# EAGLE design blank_rev_3 (EAGLE 6.3)
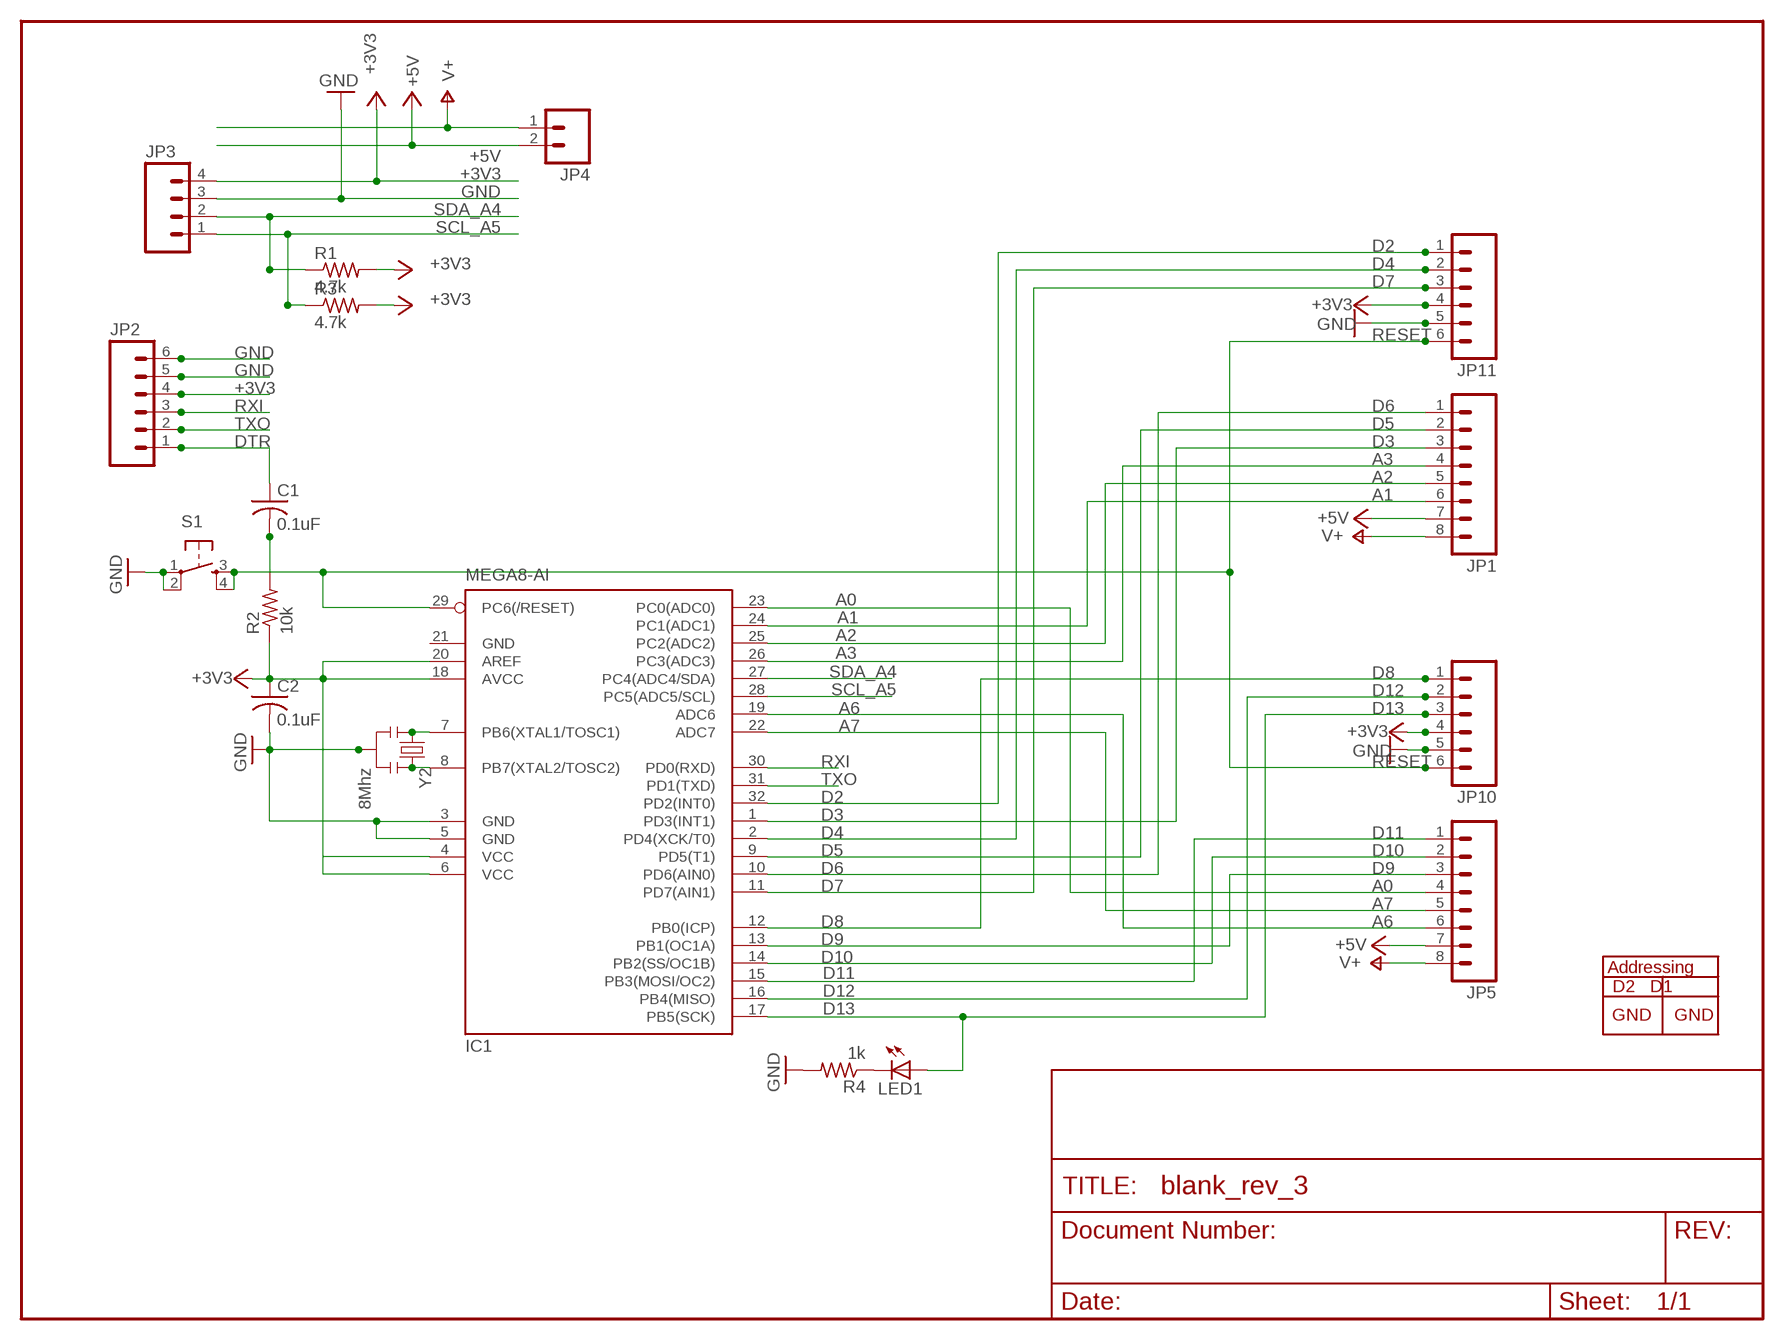
[diagram p0: schematic, sheet 1]

## Parts
C1  0.1uF  C-US025-024X044  [C025-024X044]
C2  0.1uF  C-US025-024X044  [C025-024X044]
IC1  MEGA8-AI  [TQFP32-08]
JP1  M081X08  [1X08]
JP2  M06SIP  [1X06]
JP3  M04PTH  [1X04]
JP4  M02PTH  [1X02]
JP5  M081X08  [1X08]
JP10  M06SIP  [1X06]
JP11  M06SIP  [1X06]
LED1  LED3MM  [LED3MM]
R1  4.7k  R-US_0204/7  [0204/7]
R2  10k  R-US_0204/7  [0204/7]
R3  4.7k  R-US_0204/7  [0204/7]
R4  1k  R-US_0204/7  [0204/7]
S1  TAC_SWITCHPTH  [TACTILE-PTH]
Y2  8Mhz  RESONATORPTH  [RESONATOR-PTH]

## Nets
+3V3: C2.1 IC1.4(VCC) IC1.6(VCC) IC1.18(AVCC) IC1.20(AREF) JP2.4 JP3.4 JP10.4 JP11.4 R1.2 R2.1 R3.2
+5V: JP1.7 JP4.2 JP5.7
A0: IC1.23(PC0(ADC0)) JP5.4
A1: IC1.24(PC1(ADC1)) JP1.6
A2: IC1.25(PC2(ADC2)) JP1.5
A3: IC1.26(PC3(ADC3)) JP1.4
A6: IC1.19(ADC6) JP5.6
A7: IC1.22(ADC7) JP5.5
D2: IC1.32(PD2(INT0)) JP11.1
D3: IC1.1(PD3(INT1)) JP1.3
D4: IC1.2(PD4(XCK/T0)) JP11.2
D5: IC1.9(PD5(T1)) JP1.2
D6: IC1.10(PD6(AIN0)) JP1.1
D7: IC1.11(PD7(AIN1)) JP11.3
D8: IC1.12(PB0(ICP)) JP10.1
D9: IC1.13(PB1(OC1A)) JP5.3
D10: IC1.14(PB2(SS/OC1B)) JP5.2
D11: IC1.15(PB3(MOSI/OC2)) JP5.1
D12: IC1.16(PB4(MISO)) JP10.2
D13: IC1.17(PB5(SCK)) JP10.3 LED1.A
DTR: C1.1 JP2.1
GND: C2.2 IC1.3(GND) IC1.5(GND) JP2.5 JP2.6 JP3.3 JP10.5 JP11.5 R4.2 S1.1 S1.2 Y2.2
N$1: IC1.8(PB7(XTAL2/TOSC2)) Y2.3
N$3: IC1.7(PB6(XTAL1/TOSC1)) Y2.1
N$4: LED1.K(C) R4.1
RESET: C1.2 IC1.29(PC6(/RESET)) JP10.6 JP11.6 R2.2 S1.3 S1.4
RXI: IC1.30(PD0(RXD)) JP2.3
SCL_A5: IC1.28(PC5(ADC5/SCL)) JP3.1 R3.1
SDA_A4: IC1.27(PC4(ADC4/SDA)) JP3.2 R1.1
TXO: IC1.31(PD1(TXD)) JP2.2
V+: JP1.8 JP4.1 JP5.8

## Power pins joined to a net without a drawn wire
GND: IC1.21(GND)

## Library data of the parts
C1 C2 = adafruit:C-US: CAPACITOR, American symbol
IC1 = atmel:MEGA8: MICROCONTROLLER 8 Kbytes FLASH, 1 kbytes SRAM, 512 bytes EEPROM, USART, 6-channel 10 bit ADC, 2-channel 8 bit ADC Pin compatible with Atmega48, ATMega88, ATMega168 Source: avr.lbr; MPN: ATMEGA8-16AU; OC_FARNELL: 9171371; OC_NEWARK: 73M8863
JP1 JP5 = SparkFun_mod:M08: Header 8 Standard 8-pin 0.1" header. Use with straight break away headers (SKU : PRT-00116), right angle break away headers (PRT-00553), swiss pins (PRT-00743), machine pins (PRT-00117), and female headers (PRT-00115).
JP2 JP10 JP11 = SparkFun_mod:M06: Header 6 Standard 6-pin 0.1" header. Use with straight break away headers (SKU : PRT-00116), right angle break away headers (PRT-00553), swiss pins (PRT-00743), machine pins (PRT-00117), and female headers (PRT-00115). Molex polarized connector foot print use with SKU : PRT-08094 with associated crimp pins and housings. NOTES ON THE VARIANTS LOCK and LOCK_LONGPADS... This footprint was designed to help hold the alignment of a through-hole component (i.e. 6-pin header) while soldering it into place. You may notice that each hole has been shifted either up or down by 0.005 of an inch from it's more standard position (which is a perfectly straight line). This slight alteration caused the pins (the squares in the middle) to touch the edges of the holes. Because they are alternating, it causes a "brace" to hold the component in place. 0.005 has proven to be the perfect amount of "off-center" position when using our standard breakaway headers. Although looks a little odd when you look at the bare footprint, once you have a header in there, the alteration is very hard to notice. Also, if you push a header all the way into place, it is covered up entirely on the bottom side. This idea of altering the position of holes to aid alignment will be further integrated into the Sparkfun Library for other footprints. It can help hold any component with 3 or more connection pins.
JP3 = SparkFun_mod:M04: Header 4 Standard 4-pin 0.1" header. Use with straight break away headers (SKU : PRT-00116), right angle break away headers (PRT-00553), swiss pins (PRT-00743), machine pins (PRT-00117), and female headers (PRT-00115). Molex polarized connector foot print use with SKU : PRT-08231 with associated crimp pins and housings. 1MM SMD Version SKU: PRT-10208
JP4 = SparkFun_mod:M02: Header 2 Standard 2-pin 0.1" header. Use with straight break away headers (SKU : PRT-00116), right angle break away headers (PRT-00553), swiss pins (PRT-00743), machine pins (PRT-00117), and female headers (PRT-00115). Molex polarized connector foot print use with SKU : PRT-08233 with associated crimp pins and housings.
LED1 = adafruit:LED: LED OSRAM: - CHIPLED LG R971, LG N971, LY N971, LG Q971, LY Q971, LO R971, LY R971 LH N974, LH R974 LS Q976, LO Q976, LY Q976 LO Q996 - Hyper CHIPLED LW Q18S LB Q993, LB Q99A, LB R99A - SideLED LS A670, LO A670, LY A670, LG A670, LP A670 LB A673, LV A673, LT A673, LW A673 LH A674 LY A675 LS A676, LA A676, LO A676, LY A676, LW A676 LS A679, LY A679, LG A679 - Hyper Micro SIDELED® LS Y876, LA Y876, LO Y876, LY Y876 LT Y87S - SmartLED LW L88C, LW L88S LB L89C, LB L89S, LG L890 LS L89K, LO L89K, LY L89K LS L896, LA L896, LO L896, LY L896 - TOPLED LS T670, LO T670, LY T670, LG T670, LP T670 LSG T670, LSP T670, LSY T670, LOP T670, LYG T670 LG T671, LOG T671, LSG T671 LB T673, LV T673, LT T673, LW T673 LH T674 LS T676, LA T676, LO T676, LY T676, LB T676, LH T676, LSB T676, LW T676 LB T67C, LV T67C, LT T67C, LS T67K, LO T67K, LY T67K, LW E67C LS E67B, LA E67B, LO E67B, LY E67B, LB E67C, LV E67C, LT E67C LW T67C LS T679, LY T679, LG T679 LS T770, LO T770, LY T770, LG T770, LP T770 LB T773, LV T773, LT T773, LW T773 LH T774 LS E675, LA E675, LY E675, LS T675 LS T776, LA T776, LO T776, LY T776, LB T776 LHGB T686 LT T68C, LB T68C - Hyper Mini TOPLED® LB M676 - Mini TOPLED Santana® LG M470 LS M47K, LO M47K, LY M47K Source: http://www.osram.convergy.de/
R1-R4 = adafruit:R-US_: RESISTOR, American symbol
S1 = SparkFun:TAC_SWITCH: Momentary Switch Button commonly used for reset or general input. Spark Fun Electronics SKU : COM-00097
Y2 = SparkFun_mod:RESONATOR: Resonator Small SMD resonator. This is the itty bitty 10/20MHz resonators with built in caps. CSTCE10M0G55 and CSTCE20M0V53. Footprint has been reviewed closely but hasn't been tested yet.

## Net classes
0 default: width 0.203 mm
1 vcc: width 0.254 mm

## Board
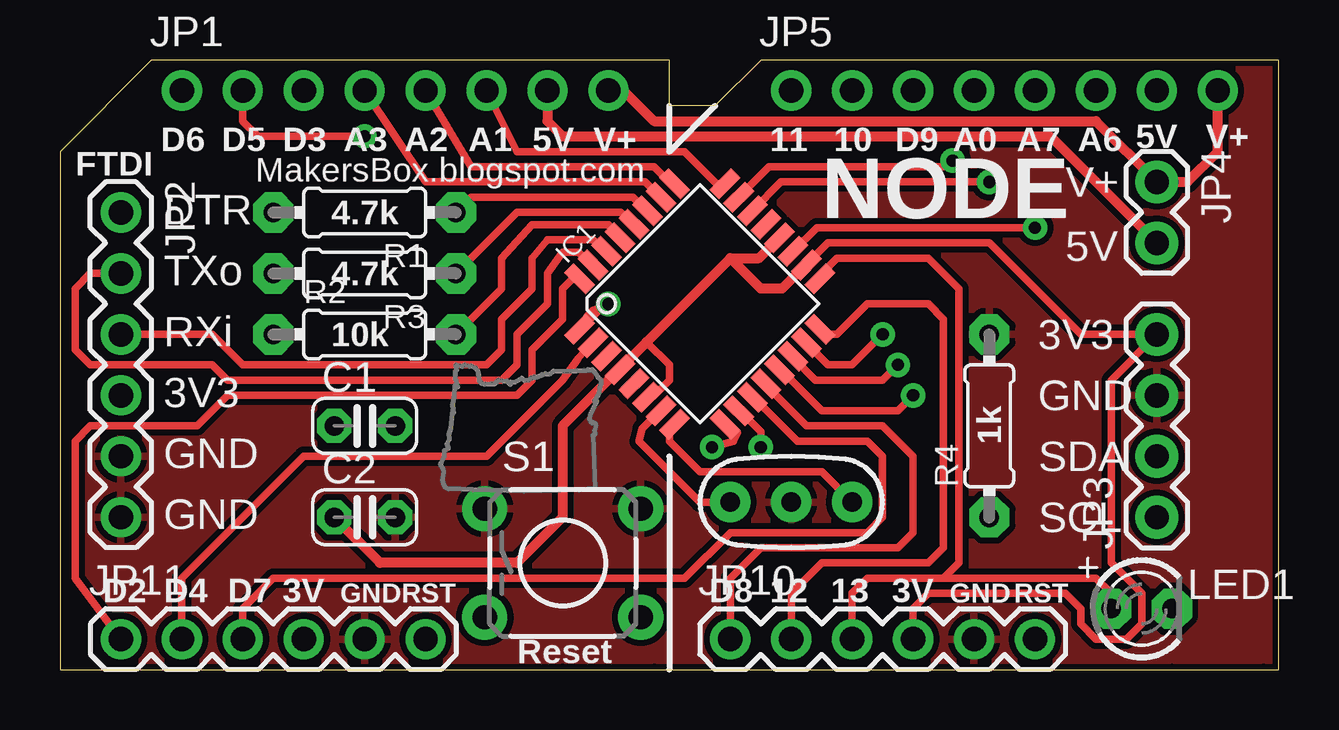
[diagram p1: board, top side]
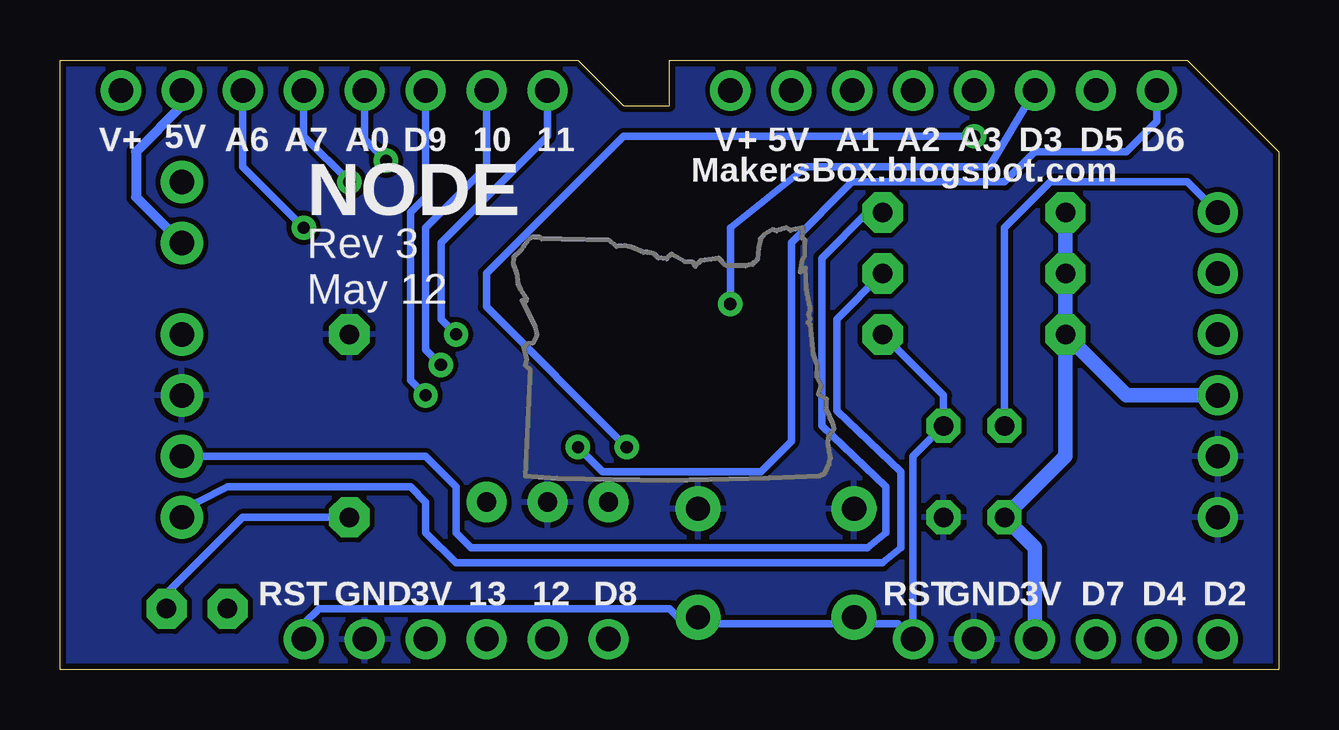
[diagram p2: board, bottom side, seen from below]

Size 50.8 x 25.4 mm. Coordinates in mm from the lower left corner, seen from the top.
Outline: 50.8,25.4 50.8,21.59 50.8,0 50.17,0 46.36,0 25.4,0 24.77,0 20.96,0 0,0 0,21.59
Outline: 50.8,25.4 29.21,25.4 27.3,23.5 25.4,23.5
Outline: 25.4,23.5 25.4,23.5
Outline: 25.4,23.5 25.4,25.4
Outline: 25.4,25.4 3.81,25.4 0,21.59
Outline: 0,21.59 0,21.59
Copper layers (1*16): Top 0.035mm / dielectric 1.5mm / Bottom 0.035mm
Design rules "SparkFun": minimum track width 8mil, minimum drill 20mil, track to track 8mil, track to pad 8mil, pad to pad 8mil, via to via 8mil, smd to smd 8mil, copper to edge 10mil, drill to drill 8mil, minimum pad ring 12mil, minimum via ring 10mil, stop-mask expansion 4mil, vias tented up to drill 25mil, thermal gap 10mil

### Footprints (pad centres in the part's own frame; a part is rotated, then mirrored left to right if it is on the bottom)
C025-024X044 = drill 0.813 pad 1.422 octagon: 1 -1.27,0; 2 1.27,0
TQFP32-08 = smd 1.27 x 0.559: 1 -4.293,2.8; 2 -4.293,2; 3 -4.293,1.2; 4 -4.293,0.4; 5 -4.293,-0.4; 6 -4.293,-1.2; 7 -4.293,-2; 8 -4.293,-2.8; 17 4.293,-2.8; 18 4.293,-2; 19 4.293,-1.2; 20 4.293,-0.4; 21 4.293,0.4; 22 4.293,1.2; 23 4.293,2; 24 4.293,2.8 | smd 0.559 x 1.27: 9 -2.8,-4.293; 10 -2,-4.293; 11 -1.2,-4.293; 12 -0.4,-4.293; 13 0.4,-4.293; 14 1.2,-4.293; 15 2,-4.293; 16 2.8,-4.293; 25 2.8,4.293; 26 2,4.293; 27 1.2,4.293; 28 0.4,4.293; 29 -0.4,4.293; 30 -1.2,4.293; 31 -2,4.293; 32 -2.8,4.293
1X08 = drill 1.016 pad 1.676: 1 0,0; 2 2.54,0; 3 5.08,0; 4 7.62,0; 5 10.16,0; 6 12.7,0; 7 15.24,0; 8 17.78,0
1X06 = drill 1.016 pad 1.676: 1 0,0; 2 2.54,0; 3 5.08,0; 4 7.62,0; 5 10.16,0; 6 12.7,0
1X04 = drill 1.016 pad 1.778: 1 0,0; 2 2.54,0; 3 5.08,0; 4 7.62,0
1X02 = drill 1.016 pad 1.778: 1 0,0; 2 2.54,0
LED3MM = drill 0.813 pad 1.676 octagon: A -1.27,0; K 1.27,0
0204/7 = drill 0.813 pad 1.676 octagon: 1 -3.81,0; 2 3.81,0
TACTILE-PTH = drill 1.016 pad 1.88: 1 -3.251,2.261; 2 3.251,2.261; 3 -3.251,-2.261; 4 3.251,-2.261
RESONATOR-PTH = drill 0.8 pad 1.676: 1 -2.54,0; 2 0,0; 3 2.54,0

### Placement (x,y rotation side)
C1  12.7,10.16 0 top
C2  12.7,6.35 0 top
IC1  26.67,15.24 45 top
JP1  5.08,24.13 0 top
JP2  2.54,19.05 270 top
JP3  45.72,6.35 90 top
JP4  45.72,20.32 270 top
JP5  30.48,24.13 0 top
JP10  27.94,1.27 0 top
JP11  2.54,1.27 0 top
LED1  45.09,2.54 0 top
R1  12.7,19.05 180 top
R2  12.7,13.97 0 top
R3  12.7,16.51 180 top
R4  38.73,10.16 90 top
S1  20.95,4.45 0 top
U$1  [OREGON_09_52]  19.81,18.41 0 top
U$2  [OREGON_18_51]  16.51,12.7 0 top
Y2  30.48,6.99 0 top

### Tracks (layer width: path | path; a pad name or v marks a point on that pad's centre or on a via)
+3V3
  Top 0.305: 24.48,11.4 24.74,11.4 25.4,12.06 25.4,12.7 24.45,13.65 | 31.09,16.86 32,17.78 38.73,17.78 42.55,13.97 JP3.4 43.81,12.06 43.81,4.45 45.09,3.17 45.09,1.91 44.45,1.27 43.18,1.27 42.55,1.91 42.55,2.54 41.91,3.17 36.2,3.17 35.56,2.54 JP10.4
  Top 0.406: 27.94,17.14 24.45,13.65 23.35,12.56 IC1.4 23.28,12.49 20.95,10.16 20.95,6.35 19.05,4.45 13.34,4.45 C2.1 | 27.94,17.14 29.14,17.14 IC1.20 | IC1.6 24.48,11.4 | IC1.18 31.09,16.86 30.1,15.88 29.21,15.88 27.94,17.14
  Bottom 0.61: JP11.4 10.16,5.08 C2.1 8.89,8.89 R2.1 | R2.1 R3.2 R1.2 | JP2.4 6.35,11.43 R2.1
+5V
  Top 0.406: JP1.7 20.32,22.86 20.95,22.23 41.27,22.23 JP4.2
  Bottom 0.406: JP5.7 45.72,23.5 47.62,21.59 47.62,19.68 JP4.2
A0  (via drill 0.51)
  Top 0.305: IC1.23 29.56,20.95 36.83,20.95 v37.21,21.21
  Bottom 0.305: JP5.4 38.1,22.1 v37.21,21.21
A1
  Top 0.305: IC1.24 27.37,20.25 26.04,21.59 19.05,21.59 JP1.6
A2
  Top 0.305: IC1.25 25.46,20.25 24.77,20.95 17.14,20.95 JP1.5
A3
  Top 0.305: IC1.26 25.01,19.69 24.38,20.32 15.24,20.32 JP1.4
A6  (via drill 0.51)
  Top 0.305: v40.64,18.41 31.54,18.41 IC1.19
  Bottom 0.305: JP5.6 43.18,20.95 v40.64,18.41
A7  (via drill 0.51)
  Top 0.305: v38.73,20.32 30.05,20.32 IC1.22
  Bottom 0.305: JP5.5 40.64,22.23 v38.73,20.32
D2
  Top 0.305: IC1.32 21.66,16.45 21.59,16.51 20.95,15.88 20.95,14.61 19.68,13.34 19.68,12.06 19.05,11.43 6.99,11.43 5.71,10.16 1.27,10.16 0.64,9.53 0.64,3.81 JP11.1
D3  (via drill 0.51)
  Top 0.305: IC1.1 21.4,13.91 22.61,15.11 21.97,14.73 22.23,14.99 v22.86,15.24
  Bottom 0.305: JP1.3 12.06,20.95 19.68,20.95 22.86,18.41 v22.86,15.24
D4
  Top 0.305: IC1.2 22.13,13.62 21.59,12.95 20.95,12.06 17.78,8.89 10.16,8.89 5.08,3.81 JP11.2
D5  (via drill 0.51)
  Top 0.305: IC1.9 28.23,9.87 28.07,9.53 v27.18,9.27 | JP1.2 7.62,22.86 8.26,22.23 v12.7,22.23
  Bottom 0.305: v27.18,9.27 33.02,15.11 33.02,16.51 27.3,22.23 v12.7,22.23
D6  (via drill 0.51)
  Top 0.305: IC1.10 28.29,10.82 29.21,9.91 v29.21,9.27
  Bottom 0.305: JP1.1 5.08,22.86 6.35,21.59 10.16,21.59 11.43,20.32 17.78,20.32 20.32,17.78 20.32,9.53 21.59,8.26 28.19,8.26 v29.21,9.27
D7
  Top 0.305: IC1.11 29.11,11.15 30.73,9.53 33.66,9.53 34.29,8.89 34.29,6.35 33.66,5.71 27.94,5.71 26.04,3.81 8.89,3.81 7.62,2.54 JP11.3
D8
  Top 0.305: IC1.12 29.42,11.85 31.11,10.16 34.29,10.16 35.56,8.89 35.56,5.71 34.92,5.08 29.21,5.08 27.94,3.81 JP10.1
D9  (via drill 0.51)
  Top 0.305: IC1.13 30.06,12.49 31.75,10.79 34.92,10.79 v35.56,11.43
  Bottom 0.305: JP5.3 35.56,19.68 36.2,19.05 36.2,12.06 v35.56,11.43
D10  (via drill 0.51)
  Top 0.305: IC1.14 30.51,13.05 31.5,12.06 34.29,12.06 v34.92,12.7
  Bottom 0.305: JP5.2 33.02,20.95 35.56,18.41 35.56,13.34 v34.92,12.7
D11  (via drill 0.51)
  Top 0.305: IC1.15 31.09,13.62 32,12.7 33.02,12.7 v34.29,13.97
  Bottom 0.305: JP5.1 30.48,22.23 34.92,17.78 34.92,14.61 v34.29,13.97
D12
  Top 0.305: IC1.16 31.68,14.04 31.75,13.97 32.38,13.97 33.66,15.24 36.2,15.24 36.83,14.61 36.83,5.08 36.2,4.45 31.75,4.45 30.48,3.17 JP10.2
D13
  Top 0.305: IC1.17 31.68,16.45 32.38,17.14 36.2,17.14 37.47,15.88 37.47,4.45 36.83,3.81 | 36.83,3.81 33.66,3.81 33.02,3.17 JP10.3 | LED1.A 43.81,3.17 43.18,3.81 36.83,3.81
DTR
  Bottom 0.305: JP2.1 3.81,20.32 9.53,20.32 11.43,18.41 C1.1
GND
  pour Bottom: -2.54,26.67 52.07,26.67 52.07,-1.27 -2.54,-1.27
  pour Top (isolate 0.254): -1.91,26.04 52.07,26.04 52.07,0 51.44,-0.64 -1.91,-0.64
N$1
  Top 0.305: Y2.3 31.75,8.26 26.67,8.26 25.4,9.53 25.4,10.01 IC1.8
N$3
  Top 0.305: IC1.7 24.89,10.66 24.26,10.03 24.13,9.53 26.67,6.99 Y2.1
N$4
  Bottom 0.305: R4.1 43.18,6.35 46.35,3.17 LED1.K
RESET
  Top 0.305: IC1.29 23.28,17.99 22.86,18.54 19.68,18.54 18.41,17.14 18.41,15.88 R2.2
  Bottom 0.305: R2.2 13.97,11.43 C1.2 15.24,8.89 JP11.6 15.88,1.91 18.06,1.91 S1.3 18.34,1.98 18.41,1.91 24.56,1.91 | 24.56,1.91 S1.4 | 24.56,1.91 24.77,1.91 25.4,2.54 40.01,2.54 40.64,1.91 JP10.6
RXI
  Top 0.305: IC1.30 22.7,17.43 22.23,17.91 20.32,17.91 19.68,17.14 19.68,15.88 18.41,14.61 18.41,13.34 17.78,12.7 7.62,12.7 6.35,13.97 JP2.3
SCL_A5
  Top 0.305: IC1.28 23.86,18.56 23.37,19.05 19.05,19.05 R3.1
  Bottom 0.305: JP3.1 45.09,6.99 43.81,7.62 36.2,7.62 35.56,6.99 35.56,5.71 34.29,4.45 16.51,4.45 15.75,5.08 15.75,8.26 18.41,10.79 18.41,14.61 R3.1
SDA_A4
  Top 0.305: IC1.27 24.44,19.12 23.88,19.68 17.14,19.68 R1.1
  Bottom 0.305: JP3.2 35.56,8.89 34.29,7.62 34.29,5.71 33.66,5.08 17.14,5.08 16.38,5.71 16.38,7.62 19.05,10.16 19.05,17.14 17.14,19.05 R1.1
TXO
  Top 0.305: IC1.31 22.25,16.86 21.59,17.4 20.95,17.4 20.32,16.51 20.32,15.24 19.05,13.97 19.05,12.7 18.41,12.06 6.99,12.06 6.35,12.7 1.27,12.7 0.64,13.34 0.64,15.88 1.27,16.51 JP2.2
V+
  Top 0.406: JP1.8 23.5,24.13 24.77,22.86 43.18,22.86 JP4.1 46.99,20.32 48.26,21.59 JP5.8

### Text on the board
tPlace: D6 | D5 | D3 | A3 | A2 | A1 | 5V | V+ | 11 | 10 | D9 | A0 | A7 | A6 | 5V | V+ | FTDI | MakersBox.blogspot.com | V+ | DTR | 4.7k | NODE | 5V | TXo | 4.7k | RXi | 10k | 3V3 | 3V3 | GND | 1k | GND | SDA | GND | SCL | D2 | D4 | D7 | 3V | GND | RST | D8 | 12 | 13 | 3V | GND | RST | Reset
bPlace: D6 | D5 | D3 | A3 | A2 | A1 | 5V | V+ | 11 | 10 | D9 | A0 | A7 | 5V | V+ | A6 | MakersBox.blogspot.com | NODE | Rev 3 / May 12 | D2 | D4 | D7 | 3V | GND | RST | D8 | 12 | 13 | 3V | GND | RST